# EAGLE design lpg_v21_4hp (EAGLE 9.5.2)
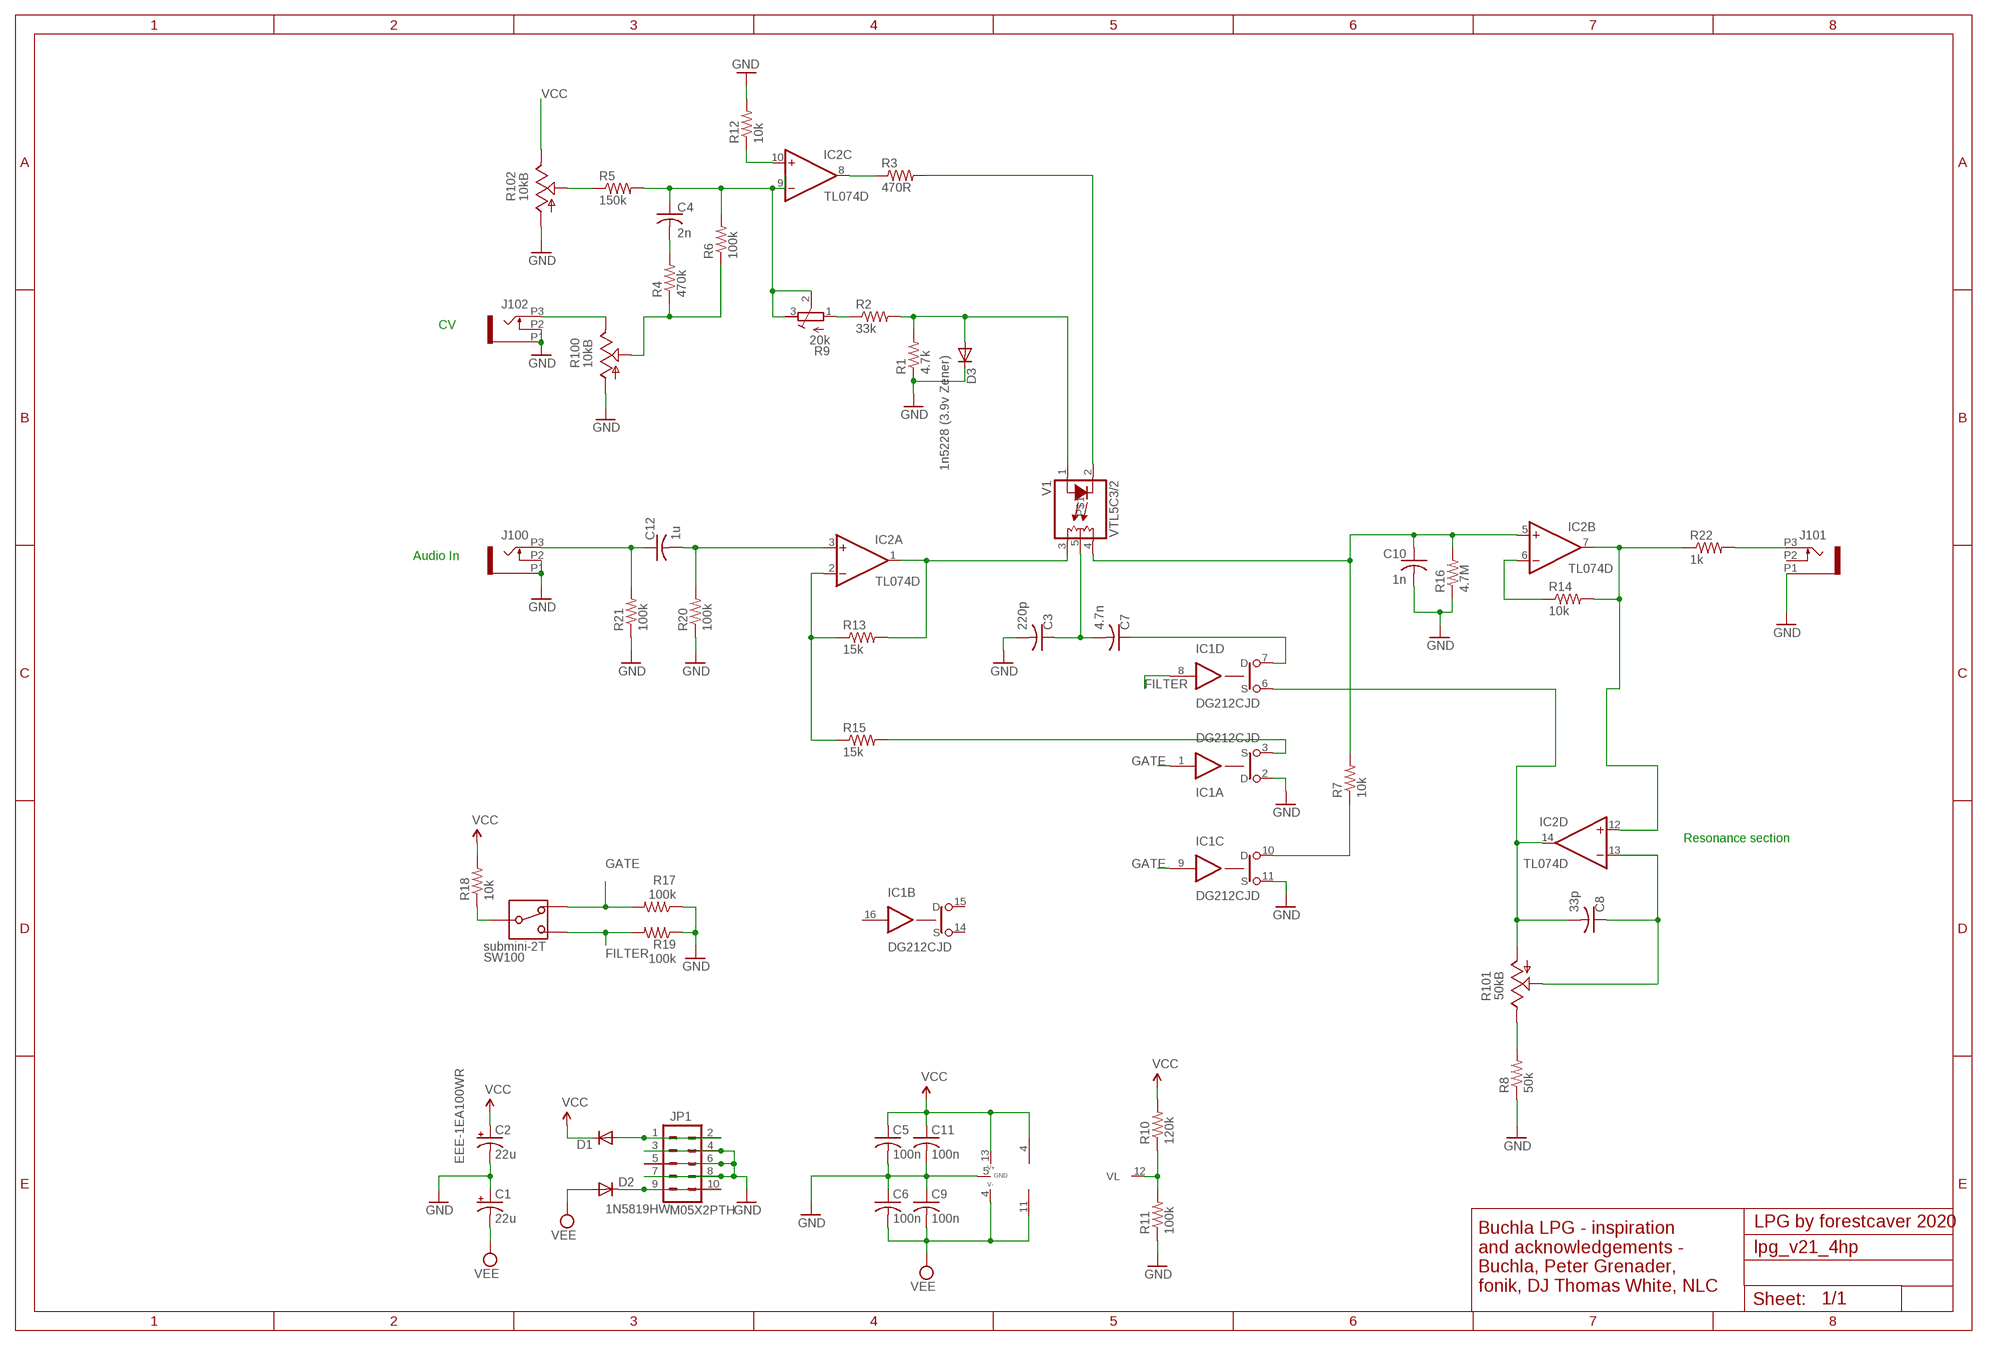
[diagram p0: schematic, sheet 1]

## Parts
C1  22u  CPOL-USB  [PANASONIC_B]
C2  22u  CPOL-USB  [PANASONIC_B]
C3  220p  C-USC0603  [C0603]
C4  2n  C-USC0603  [C0603]
C5  100n  C-USC0603  [C0603]
C6  100n  C-USC0603  [C0603]
C7  4.7n  C-USC0603  [C0603]
C8  33p  C-USC0603  [C0603]
C9  100n  C-USC0603  [C0603]
C10  1n  C-USC0603  [C0603]
C11  100n  C-USC0603  [C0603]
C12  1u  C-USC0603  [C0603]
D1  1N5819HW  DIODE-SOD123  [SOD123]
D2  1N5819HW  DIODE-SOD123  [SOD123]
D3  1n5228 (3.9v Zener)  DIODE-SOD123  [SOD123]
IC1  DG212CJD  [SO16]
IC2  TL074D  [SO14]
J100  PJ301_THONKICONN6  [WQP_PJ_301M6]
J101  PJ301_THONKICONN6  [WQP_PJ_301M6]
J102  PJ301_THONKICONN6  [WQP_PJ_301M6]
JP1  M05X2PTH  [AVR_ICSP]
R1  4.7k  R-US_R0603  [R0603]
R2  33k  R-US_R0603  [R0603]
R3  470R  R-US_R0603  [R0603]
R4  470k  R-US_R0603  [R0603]
R5  150k  R-US_R0603  [R0603]
R6  100k  R-US_R0603  [R0603]
R7  10k  R-US_R0603  [R0603]
R8  50k  R-US_R0603  [R0603]
R9  20k  R-TRIMM3296X  [RTRIM3296X]
R10  120k  R-US_R0603  [R0603]
R11  100k  R-US_R0603  [R0603]
R12  10k  R-US_R0603  [R0603]
R13  15k  R-US_R0603  [R0603]
R14  10k  R-US_R0603  [R0603]
R15  15k  R-US_R0603  [R0603]
R16  4.7M  R-US_R0603  [R0603]
R17  100k  R-US_R0603  [R0603]
R18  10k  R-US_R0603  [R0603]
R19  100k  R-US_R0603  [R0603]
R20  100k  R-US_R0603  [R0603]
R21  100k  R-US_R0603  [R0603]
R22  1k  R-US_R0603  [R0603]
R100  10kB  POT_USVERTICAL_PS  [ALPS_POT_VERTICAL_PS]
R101  50kB  POT_USVERTICAL_PS  [ALPS_POT_VERTICAL_PS]
R102  10kB  POT_USVERTICAL_PS  [ALPS_POT_VERTICAL_PS]
SW100  submini-2T  SPDTT  [SPDT-SUB]
V1  VTL5C3/2  VACTROL_5PIN  [VACTROL_5PIN_VTL5C-2]

## Nets
FILTER: IC1.8(D:IN) R19.2 SW100.P$1
GATE: IC1.1(A:IN) IC1.9(C:IN) R17.2 SW100.P$3
GND: C1.+ C2.- C3.2 C5.2 C6.1 C9.1 C10.2 C11.2 D3.C IC1.2(A:D) IC1.5(P:GND) IC1.11(C:S) J100.P1 J100.P2 J101.P1 J102.P1 J102.P2 JP1.3 JP1.4 JP1.5 JP1.6 JP1.7 JP1.8 R1.1 R8.1 R11.1 R12.2 R16.1 R17.1 R19.1 R20.1 R21.1 R100.P$3(A) R102.P$3(A)
N$1: IC1.3(A:S) R15.2
N$2: C8.2 IC1.6(D:S) IC2.14(D:OUT) R101.P$3(A)
N$3: IC1.10(C:D) R7.1
N$4: IC1.12(VL:VL) R10.1 R11.2
N$5: J102.P3 R100.P$1(E)
N$6: D1.A JP1.1 JP1.2
N$7: R18.1 SW100.P$2
N$8: R5.1 R102.P$2(S)
N$9: C7.1 IC1.7(D:D)
N$10: C12.2 IC2.3(A:+IN) R20.2
N$11: R8.2 R101.P$1(E)
N$20: D2.C JP1.9 JP1.10
N$21: C4.2 R4.2
N$28: R2.1 R9.1(E)
N$29: R4.1 R6.1 R100.P$2(S)
N$42: IC2.8(C:OUT) R3.1
N$43: IC2.10(C:+IN) R12.1
N$44: C4.1 IC2.9(C:-IN) R5.2 R6.2 R9.2(S) R9.3(A)
N$45: D3.A R1.2 R2.2 V1.1(A)
N$46: R3.2 V1.2(C)
N$47: C12.1 J100.P3 R21.2
N$49: IC2.2(A:-IN) R13.1 R15.1
N$50: IC2.1(A:OUT) R13.2 V1.3(L1)
N$51: C3.1 C7.2 V1.5
N$53: J101.P3 R22.2
N$54: IC2.6(B:-IN) R14.1
N$55: IC2.7(B:OUT) IC2.12(D:+IN) R14.2 R22.1
N$57: C10.1 IC2.5(B:+IN) R7.2 R16.2 V1.4(L2)
N$58: C8.1 IC2.13(D:-IN) R101.P$2(S)
VCC: C2.+ C5.1 C11.1 D1.C IC1.13(P:V+) IC2.4(P:V+) R10.2 R18.2 R102.P$1(E)
VEE: C1.- C6.2 C9.2 D2.A IC1.4(P:V-) IC2.11(P:V-)
Unconnected: IC1.14(B:S) IC1.15(B:D) IC1.16(B:IN) J101.P2

## Notes on the sheet
- CV
- Audio In
- Resonance section
- EEE-1EA100WR
- LPG by forestcaver 2020
- Buchla LPG - inspiration
  and acknowledgements -
  Buchla, Peter Grenader,
  fonik, DJ Thomas White, NLC

## Library data of the parts
C1 C2 = rcl:CPOL-US: POLARIZED CAPACITOR, American symbol; MOUSER: 667-EEE-FT1V220AR; MPN: EEE-FT1V220AR
C3 C4 C7 C8 C10 C12 = rcl:C-US: CAPACITOR, American symbol; SPICEPREFIX: C
C5 C6 C9 C11 = rcl:C-US: CAPACITOR, American symbol
D1 D2 = diode:DIODE-: DIODE
D3 = diode:DIODE-: DIODE; MOUSER: 863-MMSZ5228BT1G; MPN: MMSZ5228BT1G
IC1 = linear:DG212CJ: CMOS SWITCH; MOUSER: 584-ADG212AKRZ-R; MPN: ADG212AKRZ-REEL
IC2 = linear:TL074: OP AMP; MOUSER: 595-TL074CDR; MPN: TL074CDR
J100-J102 = og-pj301:PJ301_THONKICONN
JP1 = og-header:M05X2: Header 5x2 Standard 10-pin dual row 0.1" header. Commonly used with AVR-ISP. Use with Spark Fun Electronics SKU: PRT-00778
R1-R8 R10-R22 = resistor:R-US_: RESISTOR, American symbol
R9 = rcl:R-TRIMM: Trimm resistor
R100-R102 = pot-alps:POT_US
SW100 = malekko main:SPDT: SPDT Switch
V1 = MusicThingModular:VACTROL_5PIN: 5 Pin Vactrol Dual Resistive Photocoupler

## Board
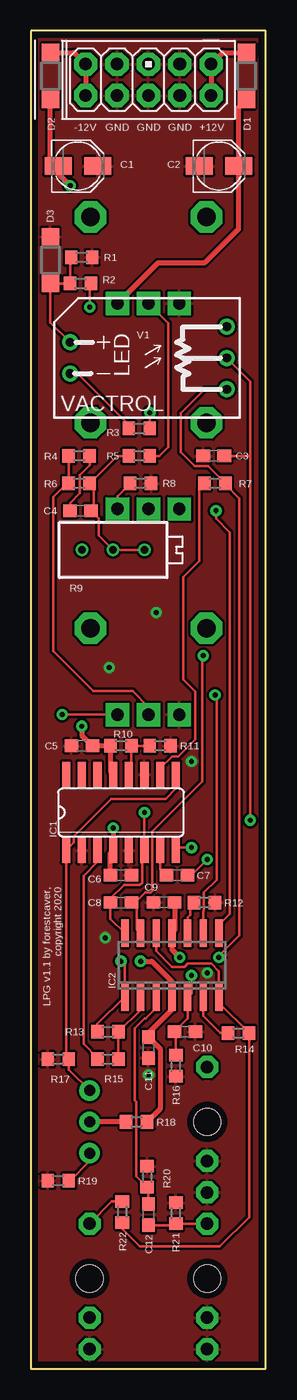
[diagram p1: board, top side]
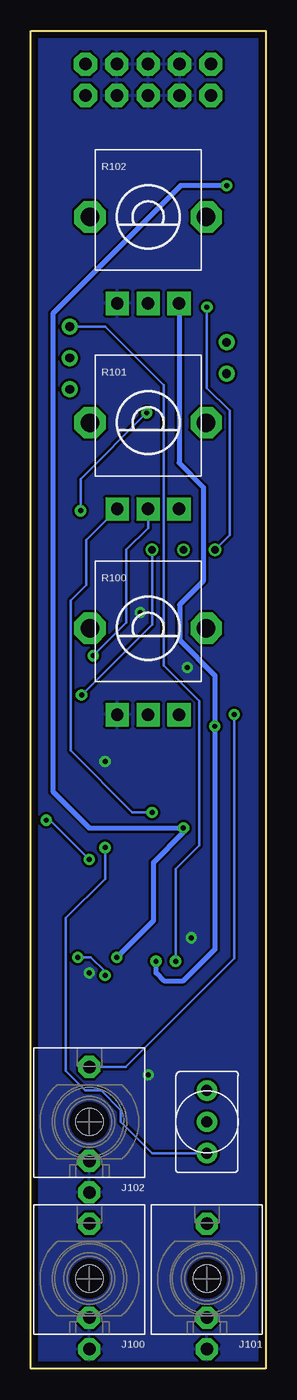
[diagram p2: board, bottom side, seen from below]

Size 19.03 x 108.43 mm. Coordinates in mm from the lower left corner, seen from the top.
Outline: 0,0 19.03,0 19.03,108.43 0,108.43 0,0
Copper layers (1*16): Top 0.035mm / dielectric 1.5mm / Bottom 0.035mm
Design rules "Mutable_PCBCart-Standard *": minimum track width 8mil, minimum drill 0.4mm, track to track 8mil, track to pad 8mil, pad to pad 8mil, via to via 8mil, smd to smd 8mil, copper to edge 20mil, drill to drill 8mil, minimum pad ring 8mil, minimum via ring 10mil, stop-mask expansion 3mil, vias tented up to drill 25mil, thermal gap 8mil

### Footprints (pad centres in the part's own frame; a part is rotated, then mirrored left to right if it is on the bottom)
PANASONIC_B = smd 2.2 x 1.4: + 1.6,0; - -1.6,0
C0603 = smd 1.1 x 1: 1 -0.85,0; 2 0.85,0
SOD123 = smd 1.4 x 1.4: A 1.9,0; C -1.9,0
SO16 = smd 0.66 x 2.032: 1 -4.445,-3.073; 2 -3.175,-3.073; 3 -1.905,-3.073; 4 -0.635,-3.073; 5 0.635,-3.073; 6 1.905,-3.073; 7 3.175,-3.073; 8 4.445,-3.073; 9 4.445,3.073; 10 3.175,3.073; 11 1.905,3.073; 12 0.635,3.073; 13 -0.635,3.073; 14 -1.905,3.073; 15 -3.175,3.073; 16 -4.445,3.073
SO14 = smd 0.6 x 2.2: 1 -3.81,-2.6; 2 -2.54,-2.6; 3 -1.27,-2.6; 4 0,-2.6; 5 1.27,-2.6; 6 2.54,-2.6; 7 3.81,-2.6; 8 3.81,2.6; 9 2.54,2.6; 10 1.27,2.6; 11 0,2.6; 12 -1.27,2.6; 13 -2.54,2.6; 14 -3.81,2.6
WQP_PJ_301M6 = drill 1.016 pad 1.778 octagon: P1 0,-5.715; P2 0,-3.175; P3 0,4.445 | hole 2.2: 0,0
AVR_ICSP = drill 1.016 pad 1.88 octagon: 1 -1.27,5.08; 2 1.27,5.08; 3 -1.27,2.54; 4 1.27,2.54; 5 -1.27,0; 6 1.27,0; 7 -1.27,-2.54; 8 1.27,-2.54; 9 -1.27,-5.08; 10 1.27,-5.08
R0603 = smd 1 x 1.1: 1 -0.85,0; 2 0.85,0
RTRIM3296X = drill 0.61: 1 0,-2.54; 2 0,0; 3 0,2.54
ALPS_POT_VERTICAL_PS = drill 1 pad 1.88 square: P$1 -2.5,7; P$2 0,7; P$3 2.5,7 | drill 1.5 pad 2.54 octagon: P$4 -4.7,0; P$5 4.7,0
SPDT-SUB = drill 0.889 pad 1.651: P$1 0,2.54; P$2 0,0; P$3 0,-2.54
VACTROL_5PIN_VTL5C-2 = drill 0.7 pad 1.3: 1 -6.35,1.27; 2 -6.35,-1.27; 3 6.35,2.54; 4 6.35,-2.54; 5 6.35,0

### Placement (x,y rotation side)
C1  3.81,97.47 0 top
C2  15.24,97.47 0 top
C3  14.82,73.98 180 top
C4  4.03,69.53 180 top
C5  4.13,50.48 180 top
C6  7.3,40.01 180 top
C7  11.85,40.01 0 top
C8  7.3,37.78 180 top
C9  10.79,37.78 0 top
C10  12.48,27.3 0 top
C11  9.53,26.03 270 top
C12  9.53,12.48 90 top
D1  17.46,104.78 90 top
D2  1.59,104.77 270 top
D3  1.59,89.85 270 top
IC1  7.3,45.09 0 top
IC2  11.43,32.7 0 top
J100  14.29,7.3 0 bottom
J101  4.76,7.3 0 bottom
J102  14.29,20 0 bottom
JP1  9.53,104.46 270 top
R1  4.13,90.07 180 top
R2  4.03,87.95 180 top
R3  8.79,76.2 180 top
R4  3.91,73.98 0 top
R5  8.79,73.98 180 top
R6  3.91,71.75 0 top
R7  14.92,71.75 0 top
R8  8.89,71.75 180 top
R9  6.67,66.36 270 top
R10  7.3,50.48 180 top
R11  10.48,50.48 180 top
R12  14.07,37.78 0 top
R13  6.25,27.3 180 top
R14  16.83,27.2 0 top
R15  6.25,25.08 180 top
R16  11.75,24.55 90 top
R17  2.22,25.08 0 top
R18  8.57,20 0 top
R19  2.22,15.24 0 top
R20  9.42,15.56 270 top
R21  11.75,12.6 270 top
R22  7.41,12.7 90 top
R100  9.53,60.01 180 bottom
R101  9.53,76.68 180 bottom
R102  9.53,93.34 180 bottom
SW100  4.76,20 180 bottom
V1  9.53,81.92 0 top

### Tracks (layer width: path | path; a pad name or v marks a point on that pad's centre or on a via)
FILTER  (via drill 0.4)
  Top 0.203: R19.2 3.17,15.24 4.76,16.83 SW100.P$1 | IC1.8 11.96,42.23 v13.02,42.23
  Bottom 0.203: v13.02,42.23 13.02,39.69 16.19,36.51 16.19,24.13 14.61,22.54 13.34,22.54 11.75,20.95 11.75,20 9.21,17.46 SW100.P$1
GATE
  Top 0.203: SW100.P$3 3.07,24.23 R17.2 2.86,25.3 IC1.1 3.49,42.65 3.49,43.15 6.53,46.19 10.92,46.19 11.75,47.02 IC1.9
GND  (via drill 0.4)
  other vias: 9.53,23.81 6.03,34.92 13.02,49.21 14.29,32.07 6.35,56.83 10.16,61.28
  pour Top: 19.05,109.76 19.05,0 -0.21,0
  pour Top: -1.59,-2.22 -1.59,109.22 -1.27,109.54 20,109.54 20.32,109.22 20.32,-0.95 20,-1.27 -0.64,-1.27
  pour Bottom: -5.08,-4.13 -5.08,111.76 -4.13,112.71 -3.81,113.03 21.59,113.03 21.59,-3.81 -4.76,-3.81
N$1
  Top 0.203: R15.2 5.4,25.19 4.28,26.31 4.28,39.94 5.4,41.06 IC1.3
N$2  (via drill 0.4)
  Top 0.203: IC2.14 6.45,36.47 C8.2 6.45,38.1 7.55,39.2 8.83,39.2 9.01,39.38 9.01,41.81 IC1.6 v9.21,45.09
  Bottom 0.203: v9.21,45.09 10.79,45.09 15.8,50.09 15.8,62.26 14.56,63.5 14.56,67.14 R101.P$3
N$3
  Top 0.203: IC1.10 10.48,48.67 11.44,49.63 11.95,49.63 13.31,50.98 13.31,54.89 12.33,55.86 12.33,64.15 13.63,65.45 13.63,71.31 R7.1
N$4
  Top 0.203: R11.2 R10.1 8.15,48.37 IC1.12
N$5  (via drill 0.4)
  Top 0.203: v2.54,53.02 7.01,53.02 R100.P$1
  Bottom 0.203: J102.P3 11.35,24.45 2.54,33.25 v2.54,53.02
N$6
  Top 0.406: JP1.2 JP1.1 15.55,106.67 D1.A
N$7
  Top 0.406: R18.1 SW100.P$2
N$8
  Top 0.203: R5.1 10.39,73.98 11.11,74.7 11.11,84.76 R102.P$2
N$9
  Top 0.203: C7.1 10.48,40.53 IC1.7
N$10
  Top 0.203: IC2.3 10.16,29.22 9.31,28.38 9.22,28.38 8.4,27.56 8.4,21.76 8.53,21.63 8.53,15.6 R20.2 9.53,14.61 C12.2
N$11
  Top 0.203: R101.P$1 7.03,70.74 R8.2
N$20
  Top 0.406: D2.C 3.5,106.67 JP1.9 JP1.10
N$21
  Top 0.203: R4.2 4.76,73.24 3.96,72.43 3.96,70.95 3.17,70.17 C4.2
N$28  (via drill 0.4)
  Top 0.203: v4.76,86.04 4.76,87.83 R2.1
  Bottom 0.203: v4.76,86.04 4.76,79.48 2.93,77.65 2.93,67.55 R9.1
N$29
  Top 0.203: R100.P$2 9.53,53.64 8.25,54.92 5.07,54.92 1.82,58.18 1.82,70.65 2.92,71.75 R6.1 R4.1
N$42  (via drill 0.4)
  Top 0.203: IC2.8 15.24,35.98 16.12,36.86 16.12,67.78 15,68.9 v15,69.53 | R3.1 v9.65,77.47
  Bottom 0.203: v15,69.53 15,72.12 v9.65,77.47
N$43
  Top 0.203: R12.1 12.9,37.47 12.9,36.78 12.7,36.57 IC2.10
N$44  (via drill 0.4)
  Top 0.203: R5.2 6.99,73.98 R6.2 5.08,71.44 5.08,69.74 C4.1 5.51,68.9 5.51,67.52 R9.2 R9.3 | IC2.9 13.97,37.05 14.03,37.11 14.03,38.58 15.05,39.6 15.05,54.49 v14.92,54.61
  Bottom 0.203: v14.92,54.61 9.21,60.33 R9.3
N$45
  Top 0.203: V1.1 1.59,84.77 D3.A R2.2 3.17,89.97 R1.2
N$46
  Top 0.203: R3.2 7.94,76.52 3.81,80.64 V1.2
N$47
  Top 0.203: J100.P3 R21.2 11.63,11.63 C12.1
N$49
  Top 0.203: IC2.2 8.89,29.1 R13.1 R15.1
N$50  (via drill 0.4)
  Top 0.203: R13.2 5.4,27.94 7.56,30.1 IC2.1 7.62,32.7 v7.3,33.02
  Bottom 0.203: v7.3,33.02 7.3,40.52 5.4,42.42 5.4,54.13 8.27,57 8.27,79.71 13.02,84.45 V1.3
N$51  (via drill 0.4)
  Top 0.203: 17.78,73.98 17.78,80.01 V1.5 | 17.78,73.98 v17.78,44.45 | v14.29,41.27 13.02,40.01 C7.2 | C3.1 17.78,73.98
  Bottom 0.203: v17.78,44.45 17.46,44.45 v14.29,41.27
N$53
  Top 0.203: J101.P3 6.57,13.55 R22.2
N$54
  Top 0.203: R14.1 15.36,27.2 13.97,28.59 IC2.6
N$55
  Top 0.203: R22.1 7.41,11.32 8.81,9.92 15.32,9.92 17.68,12.28 R14.2 15.24,29.64 IC2.7 15.24,32.19 14.6,32.83 12.7,32.83 12.45,32.58 11.43,32.58 10.16,33.85 IC2.12
N$57  (via drill 0.4)
  Top 0.203: v13.02,31.87 13.02,30.42 IC2.5 12.7,28.37 C10.1 11.75,27.19 R16.2 | v15.24,33.34 15.24,33.47 16.89,35.13 16.89,70.53 15.77,71.65 R7.2 14.36,73.17 13.29,73.17 12.16,74.3 12.16,77.46 14.08,79.38 V1.4
  Bottom 0.203: v13.02,31.87 13.02,32.19 14.17,33.34 v15.24,33.34
N$58  (via drill 0.4)
  Top 0.203: IC2.13 8.57,35.62 8.57,37.45 8.24,37.78 C8.1 8.46,37.78 9.27,38.59 9.7,38.59 9.84,38.73 9.84,43.52 13.9,47.59 13.9,57.72 v13.97,57.78
  Bottom 0.203: R101.P$2 9.53,68.14 11.29,66.38 11.29,60.47 v13.97,57.78
VCC  (via drill 0.4)
  Top 0.406: R18.2 10.47,21.05 10.47,25.94 C11.1 9.53,27.18 11.43,29.08 IC2.4 11.43,31.37 9.78,33.02 v8.89,33.02 | IC1.13 6.45,48.37 R10.2 C5.1 4.13,51.33 v4.13,52.07 | R102.P$1 10.3,89.62 14.07,89.62 16.84,92.39 C2.+ 16.84,102.25 D1.C
  Bottom 0.406: R102.P$1 7.03,73.4 5.04,71.42 5.04,63.85 6.99,61.91 6.99,59.05 4.13,56.2 v4.13,52.07 4.13,33.97 6.67,31.43 8.26,31.43 8.89,32.07 v8.89,33.02
VEE  (via drill 0.4)
  Top 0.406: C6.2 6.45,41.8 IC1.4 v6.67,43.81 | C9.2 11.64,35.52 IC2.11 11.43,33.97 v12.06,33.34 | D2.A 1.59,98.09 C1.- 2.21,96.85 v3.17,95.89
  Bottom 0.406: v3.17,95.89 6.89,95.89 17.25,85.53 17.25,46.78 14.29,43.81 v6.67,43.81 6.67,43.46 9.08,41.05 9.08,36.32 v12.06,33.34

### Text on the board
tPlace: LPG v1.1 by forestcaver, / copyright 2020
tNames: -12V | GND | GND | GND | +12V
Drill_legend: Drill legend | Date: 03/11/14 17:47 | 2.2000 mm / 86.614 mil | 1.5000 mm / 59.055 mil | 1.0160 mm / 40.000 mil | 1.0000 mm / 39.370 mil | 0.8128 mm / 32.000 mil | 0.6000 mm / 23.622 mil